# EAGLE board wuBaseV1.4PH (EAGLE 9.6.2), part 1 of 2
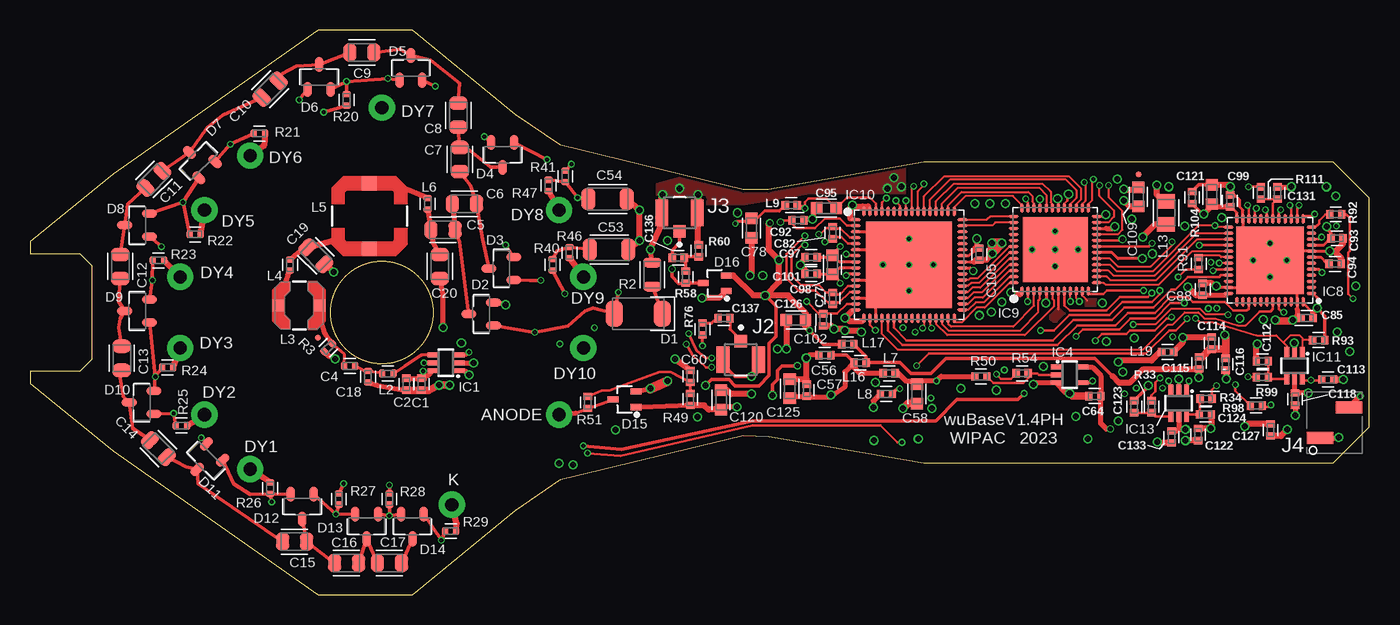
[diagram p5: board, top side]
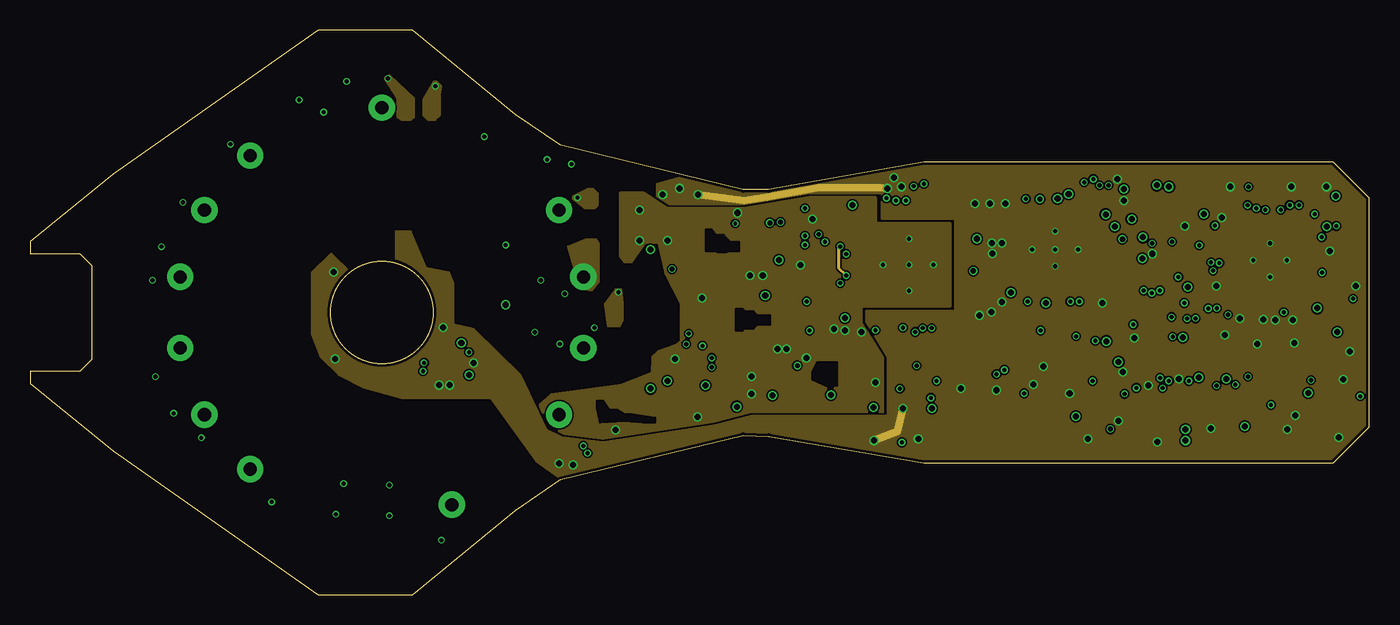
[diagram p6: board, inner layer Route2]
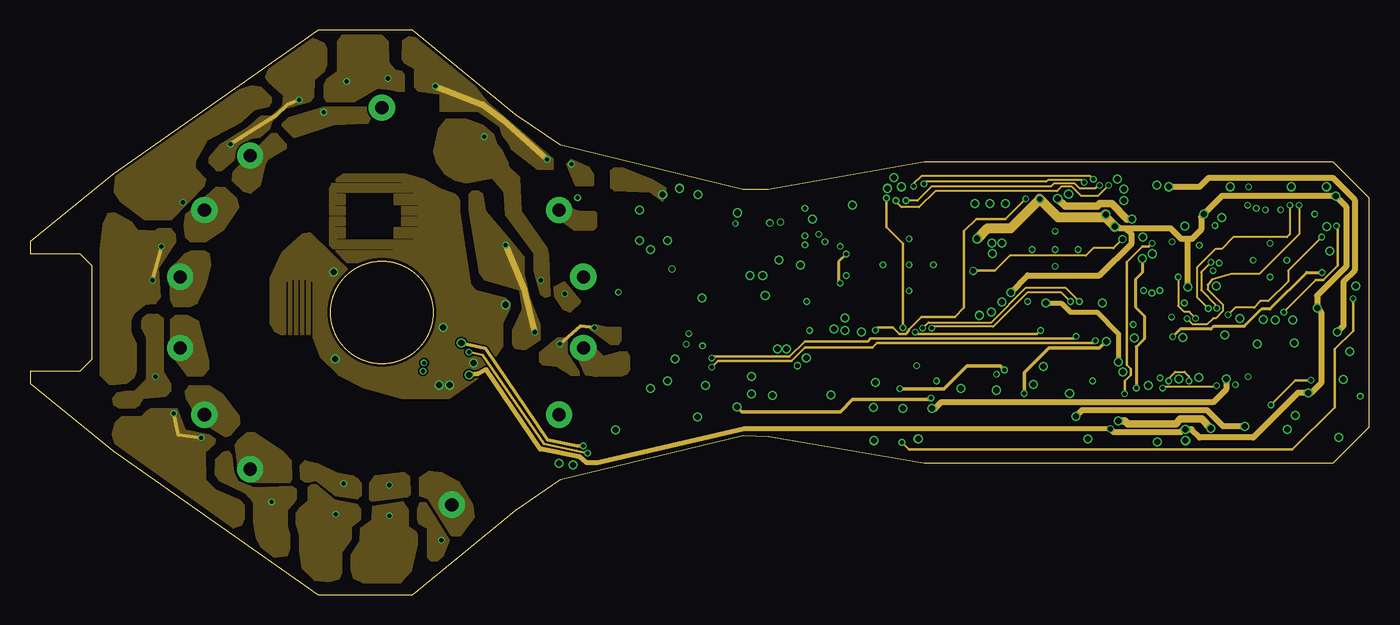
[diagram p7: board, inner layer Route15]
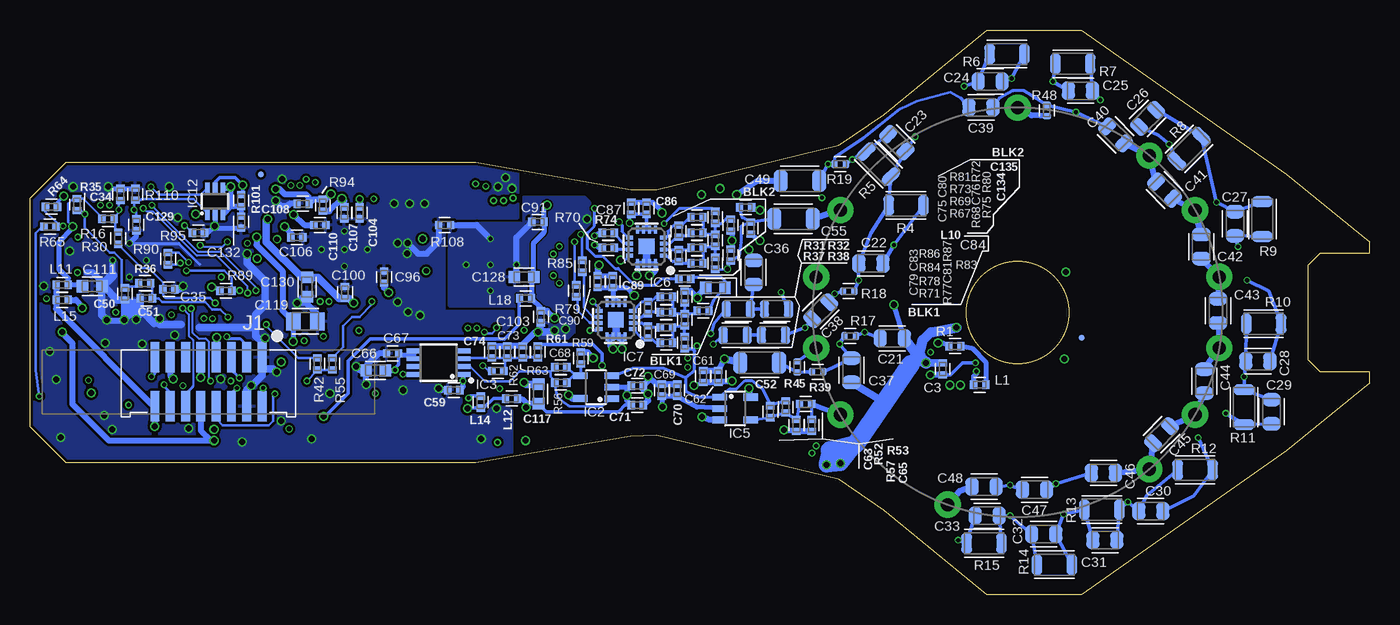
[diagram p8: board, bottom side, seen from below]

Size 111.2 x 46.9 mm. Coordinates in mm from the lower left corner, seen from the top.
Outline: 0,18.55 0,17.55 6.9,11.95 23.9,0 31.75,0 40.31,7.02 44.06,9.57 59.2,13.25 61.33,13.16 74.2,10.95 108.2,10.95 111.2,13.95 111.2,32.95 108.2,35.95 74.2,35.95 61.33,33.65 59.2,33.65 44.06,37.33 40.31,39.88 31.75,46.9 23.9,46.9 6.9,34.95 0,29.35 0,28.35 4.1,28.35 5.1,27.35 5.1,19.55 4.1,18.55 0,18.55
Outline: circle at 29.2,23.45 radius 4.25
Copper layers (1*2*15*16): Top 0.035mm / dielectric 0.23mm / Route2 0.035mm / dielectric 0.93mm / Route15 0.035mm / dielectric 0.23mm / Bottom 0.035mm
Design rules "MF_Standard_4_Layer": minimum track width 5mil, minimum drill 10mil, track to track 5mil, track to pad 5mil, pad to pad 5mil, via to via 5mil, smd to smd 0mil, copper to edge 10mil, drill to drill 10mil, minimum pad ring 4mil, minimum via ring 4mil, stop-mask expansion 2mil, vias tented up to drill 25mil, thermal gap 10mil

## Footprints (pad centres in the part's own frame; a part is rotated, then mirrored left to right if it is on the bottom)
0430-BARE = drill 1.092 pad 2.184: P$1 0,0
C0402 = smd 0.6 x 0.7: 1 -0.5,0; 2 0.5,0
C0402-HV = smd 0.56 x 0.7: 1 -0.47,0; 2 0.47,0
C0805-HV = smd 1.1 x 1.5: 1 -1,0; 2 1,0
C1206-HV = smd 1.165 x 1.815: 1 -1.6,0; 2 1.6,0
C0603 = smd 0.95 x 1: 1 -0.8,0; 2 0.8,0
C0805 = smd 1.2 x 1.5: 1 -1,0; 2 1,0
DO214AC-HV = smd 1.4 x 2.2: A 2,0; C -2,0
SOT23-ROUNDED = smd 1.242 x 0.694: 1 -1.029,0.95; 2 -1.029,-0.95; 3 1.029,0
SC70-3L = smd 0.5 x 0.9: 1 -0.65,-0.95; 2 0.65,-0.95; 3 0,0.95
FIDUCIAL_0.5MM = smd 0.5 x 0.5 bottom: FID_BOT 0,0 | smd 0.5 x 0.5: FID_TOP 0,0
SC70-6L-TI = smd 0.4 x 0.9: 1 -0.65,-1.1; 2 0,-1.1; 3 0.65,-1.1; 4 0.65,1.1; 5 0,1.1; 6 -0.65,1.1
SOT23-5 = smd 0.55 x 1.2: 1 -0.95,-1.3; 2 0,-1.3; 3 0.95,-1.3; 4 0.95,1.3 | smd 0.6 x 1.2: 5 -0.95,1.3
MSOP8 = smd 0.4 x 1.2: 1 -0.975,-2.05; 2 -0.325,-2.05; 3 0.325,-2.05; 4 0.975,-2.05; 5 0.975,2.05; 6 0.325,2.05; 7 -0.325,2.05; 8 -0.975,2.05
SC70-5L-TI = smd 0.4 x 0.9: 1 -0.65,-1.1; 2 0,-1.1; 3 0.65,-1.1; 4 0.65,1.1; 5 -0.65,1.1
LFCSP16 = smd 0.3 x 0.65: 1 -0.75,-1.4; 2 -0.25,-1.4; 3 0.25,-1.4; 4 0.75,-1.4; 9 0.75,1.4; 10 0.25,1.4; 11 -0.25,1.4; 12 -0.75,1.4 | smd 0.65 x 0.3: 5 1.4,-0.75; 6 1.4,-0.25; 7 1.4,0.25; 8 1.4,0.75; 13 -1.4,0.75; 14 -1.4,0.25; 15 -1.4,-0.25; 16 -1.4,-0.75 | smd 1.3 x 1.3: EXP 0,0
UFQFPN48-STMICRO = smd 0.86 x 0.27: 1 -3.435,2.75; 2 -3.435,2.25; 3 -3.435,1.75; 4 -3.435,1.25; 5 -3.435,0.75; 6 -3.435,0.25; 7 -3.435,-0.25; 8 -3.435,-0.75; 9 -3.435,-1.25; 10 -3.435,-1.75; 11 -3.435,-2.25; 12 -3.435,-2.75; 25 3.435,-2.75; 26 3.435,-2.25; 27 3.435,-1.75; 28 3.435,-1.25; 29 3.435,-0.75; 30 3.435,-0.25; 31 3.435,0.25; 32 3.435,0.75; 33 3.435,1.25; 34 3.435,1.75; 35 3.435,2.25; 36 3.435,2.75 | smd 0.27 x 0.86: 13 -2.75,-3.435; 14 -2.25,-3.435; 15 -1.75,-3.435; 16 -1.25,-3.435; 17 -0.75,-3.435; 18 -0.25,-3.435; 19 0.25,-3.435; 20 0.75,-3.435; 21 1.25,-3.435; 22 1.75,-3.435; 23 2.25,-3.435; 24 2.75,-3.435; 37 2.75,3.435; 38 2.25,3.435; 39 1.75,3.435; 40 1.25,3.435; 41 0.75,3.435; 42 0.25,3.435; 43 -0.25,3.435; 44 -0.75,3.435; 45 -1.25,3.435; 46 -1.75,3.435; 47 -2.25,3.435; 48 -2.75,3.435 | smd 5.6 x 5.6: 49 0,0
QFN48-ICE40ULTRA = smd 0.811 x 0.25: 1 -3.451,2.75; 2 -3.451,2.25; 3 -3.451,1.75; 4 -3.451,1.25; 5 -3.451,0.75; 6 -3.451,0.25; 7 -3.451,-0.25; 8 -3.451,-0.75; 9 -3.451,-1.25; 10 -3.451,-1.75; 11 -3.451,-2.25; 12 -3.451,-2.75; 25 3.451,-2.75; 26 3.451,-2.25; 27 3.451,-1.75; 28 3.451,-1.25; 29 3.451,-0.75; 30 3.451,-0.25; 31 3.451,0.25; 32 3.451,0.75; 33 3.451,1.25; 34 3.451,1.75; 35 3.451,2.25; 36 3.451,2.75 | smd 0.25 x 0.811: 13 -2.75,-3.451; 14 -2.25,-3.451; 15 -1.75,-3.451; 16 -1.25,-3.451; 17 -0.75,-3.451; 18 -0.25,-3.451; 19 0.25,-3.451; 20 0.75,-3.451; 21 1.25,-3.451; 22 1.75,-3.451; 23 2.25,-3.451; 24 2.75,-3.451; 37 2.75,3.451; 38 2.25,3.451; 39 1.75,3.451; 40 1.25,3.451; 41 0.75,3.451; 42 0.25,3.451; 43 -0.25,3.451; 44 -0.75,3.451; 45 -1.25,3.451; 46 -1.75,3.451; 47 -2.25,3.451; 48 -2.75,3.451 | smd 5.4 x 5.4: PAD 0,0
QFN64-LTC214X = smd 0.86 x 0.27: 1 -4.435,3.75; 2 -4.435,3.25; 3 -4.435,2.75; 4 -4.435,2.25; 5 -4.435,1.75; 6 -4.435,1.25; 7 -4.435,0.75; 8 -4.435,0.25; 9 -4.435,-0.25; 10 -4.435,-0.75; 11 -4.435,-1.25; 12 -4.435,-1.75; 13 -4.435,-2.25; 14 -4.435,-2.75; 15 -4.435,-3.25; 16 -4.435,-3.75; 33 4.435,-3.75; 34 4.435,-3.25; 35 4.435,-2.75; 36 4.435,-2.25; 37 4.435,-1.75; 38 4.435,-1.25; 39 4.435,-0.75; 40 4.435,-0.25; 41 4.435,0.25; 42 4.435,0.75; 43 4.435,1.25; 44 4.435,1.75; 45 4.435,2.25; 46 4.435,2.75; 47 4.435,3.25; 48 4.435,3.75 | smd 0.27 x 0.86: 17 -3.75,-4.435; 18 -3.25,-4.435; 19 -2.75,-4.435; 20 -2.25,-4.435; 21 -1.75,-4.435; 22 -1.25,-4.435; 23 -0.75,-4.435; 24 -0.25,-4.435; 25 0.25,-4.435; 26 0.75,-4.435; 27 1.25,-4.435; 28 1.75,-4.435; 29 2.25,-4.435; 30 2.75,-4.435; 31 3.25,-4.435; 32 3.75,-4.435; 49 3.75,4.435; 50 3.25,4.435; 51 2.75,4.435; 52 2.25,4.435; 53 1.75,4.435; 54 1.25,4.435; 55 0.75,4.435; 56 0.25,4.435; 57 -0.25,4.435; 58 -0.75,4.435; 59 -1.25,4.435; 60 -1.75,4.435; 61 -2.25,4.435; 62 -2.75,4.435; 63 -3.25,4.435; 64 -3.75,4.435 | smd 7.15 x 7.15: PAD 0,0
3M-45216-220230 = smd 0.737 x 2.54: 1 -4.445,-2.032; 2 -4.445,2.032; 3 -3.175,-2.032; 4 -3.175,2.032; 5 -1.905,-2.032; 6 -1.905,2.032; 7 -0.635,-2.032; 8 -0.635,2.032; 9 0.635,-2.032; 10 0.635,2.032; 11 1.905,-2.032; 12 1.905,2.032; 13 3.175,-2.032; 14 3.175,2.032; 15 4.445,-2.032; 16 4.445,2.032
HIROSE_U.FL-R-SMT-1 = smd 1 x 1.05: 1 0,-1.525 | smd 1.05 x 2.2: 2 1.475,0; 3 -1.475,0
HEADER-SMD-2X1-MINIMUM = smd 1 x 2.2: 1 -1.27,1.2; 2 1.27,-1.2
L0402 = smd 0.6 x 0.7: 1 -0.5,0; 2 0.5,0
L0402-HV = smd 0.56 x 0.7: 1 -0.47,0; 2 0.47,0
LPS4040-REDUCED = smd 1 x 1: 1 -1.7,0; 2 1.7,0
LPS6235-REDUCED = smd 1.2 x 1.2: 1 -2.7,0; 2 2.7,0
L0805 = smd 1.2 x 1.5: 1 -0.953,0; 2 0.953,0
R0402 = smd 0.6 x 0.7: 1 -0.5,0; 2 0.5,0
R0805-HV = smd 0.8 x 1.5: 1 -1,0; 2 1,0
R0402-HV = smd 0.56 x 0.7: 1 -0.47,0; 2 0.47,0
R1206-HV = smd 0.9 x 1.7: 1 -1.45,0; 2 1.45,0

## Placement (x,y rotation side)
ANODE  PAD-0430-BARE  [0430-BARE]  43.92,14.95 0 bottom
C1  1000pF  [C0402]  32.5,17.48 90 top
C2  0.1uF  [C0402]  31.23,17.48 90 top
C3  0.1uF  [C0402]  35.42,18.75 270 bottom
C4  0.1uF  [C0402-HV]  26.53,19 0 top
C5  2200pF/250V  [C0805-HV]  34.28,30.31 0 top
C6  2200pF/250V  [C0805-HV]  36.06,32.47 0 top
C7  2200pF/250V  [C0805-HV]  35.68,36.15 90 top
C8  2200pF/250V  [C0805-HV]  35.55,39.83 90 top
C9  2200pF/250V  [C0805-HV]  27.55,45.04 180 top
C10  2200pF/250V  [C0805-HV]  19.93,41.99 225 top
C11  2200pF/250V  [C0805-HV]  10.28,34.5 225 top
C12  2200pF/250V  [C0805-HV]  7.48,27.26 270 top
C13  2200pF/250V  [C0805-HV]  7.61,19.64 270 top
C14  2200pF/250V  [C0805-HV]  10.66,12.15 315 top
C15  2200pF/250V  [C0805-HV]  21.96,4.4 0 top
C16  2200pF/250V  [C0805-HV]  26.28,2.62 0 top
C17  2200pF/250V  [C0805-HV]  29.84,2.62 0 top
C18  100pF  [C0402-HV]  28.06,18.12 270 top
C19  3900pF/50V  [C0805-HV]  23.74,28.15 315 top
C20  220pF/100V/5%  [C0805-HV]  34.03,27.26 270 top
C21  2200pF/250V  [C0805-HV]  39.61,21.29 180 bottom
C22  2200pF/250V  [C0805-HV]  41.39,27.51 180 bottom
C23  2200pF/250V  [C0805-HV]  39.23,37.55 135 bottom
C24  2200pF/250V  [C0805-HV]  31.49,42.63 0 bottom
C25  2200pF/250V  [C0805-HV]  23.99,41.86 0 bottom
C26  2200pF/250V  [C0805-HV]  18.41,39.58 45 bottom
C27  2200pF/250V  [C0805-HV]  11.17,30.82 270 bottom
C28  2200pF/250V  [C0805-HV]  9.26,19.39 180 bottom
C29  2200pF/250V  [C0805-HV]  8.12,15.19 270 bottom
C30  2200pF/250V  [C0805-HV]  18.15,6.94 180 bottom
C31  2200pF/250V  [C0805-HV]  21.96,4.53 180 bottom
C32  2200pF/250V  [C0805-HV]  27.04,5.04 180 bottom
C33  2200pF/250V  [C0805-HV]  31.74,6.56 180 bottom
C34  0.1uF  [C0402]  103.71,33.24 90 bottom
C35  0.01uF  [C0402]  99.67,25.37 0 bottom
C36  2200pF/250V  [C0805-HV]  51.13,26.77 90 bottom
C37  2200pF/250V  [C0805-HV]  43,18.64 90 bottom
C38  2200pF/250V  [C0805-HV]  45.54,23.59 45 bottom
C39  2200pF/250V  [C0805-HV]  32.25,40.47 0 bottom
C40  2200pF/250V  [C0805-HV]  21.07,38.18 315 bottom
C41  2200pF/250V  [C0805-HV]  17.01,33.61 315 bottom
C42  2200pF/250V  [C0805-HV]  13.96,28.91 270 bottom
C43  2200pF/250V  [C0805-HV]  12.56,23.58 270 bottom
C44  2200pF/250V  [C0805-HV]  13.71,17.73 270 bottom
C45  2200pF/250V  [C0805-HV]  17.26,13.29 225 bottom
C46  2200pF/250V  [C0805-HV]  22.09,10.11 180 bottom
C47  2200pF/250V  [C0805-HV]  27.8,8.72 180 bottom
C48  2200pF/250V  [C0805-HV]  31.99,8.97 180 bottom
C49  10000pF/500V  [C1206-HV]  47.29,34.37 180 bottom
C50  0.1uF  [C0402]  103.33,24.99 270 bottom
C51  0.01uF  [C0402]  101.55,24.61 180 bottom
C52  10000pF/500V  [C1206-HV]  50.62,19.27 0 bottom
C53  10000pF/500V  [C1206-HV]  48.08,28.67 0 top
C54  10000pF/500V  [C1206-HV]  47.96,32.86 0 top
C55  10000pF/500V  [C1206-HV]  47.83,31.21 180 bottom
C56  0.1uF  [C0402]  65.99,19.91 180 top
C57  1000pF  [C0402]  64.47,16.99 90 top
C58  1uF  [C0603]  73.63,16.68 270 top
C59  0.01uF  [C0402]  76.02,16.99 180 bottom
C60  0.1uF  [C0402]  54.81,18.13 90 top
C61  0.1uF  [C0402]  55.32,18.13 90 bottom
C62  1000pF  [C0402]  54.05,18.13 90 bottom
C63  8pF  [C0402]  49.73,15.21 90 bottom
C64  0.1uF  [C0402]  88.4,16.5 0 top
C65  20pF  [C0402]  46.3,14.07 270 bottom
C66  1uF  [C0603]  82.5,18.64 180 bottom
C67  0.01uF  [C0402]  81.1,20.04 180 bottom
C68  DNL  [C0402]  67.13,18.89 180 bottom
C69  0.1uF  [C0402]  58.75,16.99 90 bottom
C70  1000pF  [C0402]  57.48,16.99 90 bottom
C71  0.1uF  [C0402]  60.78,15.74 0 bottom
C72  1000pF  [C0402]  60.78,17.37 0 bottom
C73  0.1uF  [C0402]  71.58,20.16 90 bottom
C74  1000pF  [C0402]  72.85,20.16 90 bottom
C75  3pF  [C0402]  57.35,28.16 90 bottom
C76  7.5pF  [C0402]  54.31,29.43 90 bottom
C77  7.5pF  [C0402]  66.62,24.61 270 top
C78  1uF  [C0603]  59.89,30.45 270 top
C79  4pF  [C0402]  59.89,21.81 90 bottom
C80  3pF  [C0402]  57.35,30.2 90 bottom
C81  8pF  [C0402]  56.85,22.83 90 bottom
C82  11pF  [C0402]  66.62,30.07 90 top
C83  4pF  [C0402]  59.89,23.85 90 bottom
C84  1uF  [C0603]  54.31,25.5 180 bottom
C85  0.1uF  [C0402]  106.02,22.98 180 top
C86  1000pF  [C0402]  60.02,32.1 90 bottom
C87  0.1uF  [C0402]  61.29,32.1 90 bottom
C88  0.1uF  [C0402]  97.36,25.37 90 top
C89  1000pF  [C0402]  62.81,26.01 90 bottom
C90  0.1uF  [C0402]  64.08,26.01 90 bottom
C91  0.1uF  [C0402]  69.04,30.96 180 bottom
C92  0.1uF  [C0402]  63.76,31.11 0 top
C93  0.1uF  [C0402]  108.51,29.61 0 top
C94  0.1uF  [C0402]  108.36,27.48 0 top
C95  2.2uF  [C0603]  66.12,32.1 180 top
C96  0.1uF  [C0402]  81.81,26.39 90 bottom
C97  0.1uF  [C0402]  64.85,28.04 180 top
C98  2.2uF  [C0603]  66.62,27.4 270 top
C99  0.1uF  [C0402]  99.62,32.71 90 top
C100  0.1uF  [C0402]  85.05,25.11 90 bottom
C101  0.1uF  [C0402]  64.85,26.64 180 top
C102  0.1uF  [C0402]  65.86,22.83 270 top
C103  0.1uF  [C0402]  68.78,23.09 270 bottom
C104  0.1uF  [C0402]  83.84,31.72 270 bottom
C105  0.1uF  [C0402]  78.82,28.29 270 top
C106  0.1uF  [C0402]  89.05,29.69 0 bottom
C107  0.1uF  [C0402]  85.11,31.72 270 bottom
C108  0.1uF  [C0402]  88.54,32.48 180 bottom
C109  1uF  [C0603]  92,33.05 270 top
C110  0.1uF  [C0402]  87.14,30.7 0 bottom
C111  4.7uF  [C0603]  106.04,25.62 180 bottom
C112  100pF  [C0402]  102.31,19.4 180 top
C113  100pF  [C0402]  107.75,17.88 0 top
C114  0.1uF  [C0402]  98.1,20.9 270 top
C115  0.1uF  [C0402]  97.05,19.25 90 top
C116  0.1uF  [C0402]  99.26,19.15 90 top
C117  2.2uF  [C0603]  68.99,16.68 270 bottom
C118  0.1uF  [C0402]  105.03,16.25 270 top
C119  10uF/6.3V  [C0805]  88.34,22.7 0 bottom
C120  2.2uF  [C0603]  57.38,16.17 270 top
C121  4.7uF  [C0603]  98.12,33.24 270 top
C122  0.1uF  [C0402]  96.98,13.31 90 top
C123  100pF  [C0402]  91.67,15.62 90 top
C124  100pF  [C0402]  97.59,14.98 0 top
C125  2.2uF  [C0603]  63.07,17.12 270 top
C126  2.2uF  [C0603]  63.58,22.83 0 top
C127  0.1uF  [C0402]  103,13.69 270 top
C128  4.7uF  [C0603]  70.18,26.39 0 bottom
C129  0.1uF  [C0402]  102.39,30.73 90 bottom
C130  4.7uF  [C0603]  88.22,25.55 270 bottom
C131  0.1uF  [C0402]  103.58,33.37 270 top
C132  0.1uF  [C0402]  93.68,30.96 90 bottom
C133  0.1uF  [C0402]  94.77,13.1 270 top
C134  33pF  [C0402]  51.38,30.45 270 bottom
C135  3pF  [C0402]  51.79,32.17 0 bottom
C136  0.1uF  [C0402]  53.82,27.98 180 top
C137  0.1uF  [C0402]  57.61,22.96 180 top
D1  SMAJ150A  [DO214AC-HV]  50.5,23.34 180 top
D2  BAS101S,215  [SOT23-ROUNDED]  37.45,23.32 180 top
D3  BAS101S,215  [SOT23-ROUNDED]  39.12,27.11 180 top
D4  BAS101S,215  [SOT23-ROUNDED]  39.23,36.53 270 top
D5  BAS101S,215  [SOT23-ROUNDED]  31.61,43.77 90 top
D6  BAS101S,215  [SOT23-ROUNDED]  23.99,43.01 90 top
D7  BAS101S,215  [SOT23-ROUNDED]  13.96,36.02 135 top
D8  BAS101S,215  [SOT23-ROUNDED]  8.88,30.69 180 top
D9  BAS101S,215  [SOT23-ROUNDED]  8.88,23.58 180 top
D10  BAS101S,215  [SOT23-ROUNDED]  9.26,15.96 180 top
D11  BAS101S,215  [SOT23-ROUNDED]  14.59,11.13 225 top
D12  BAS101S,215  [SOT23-ROUNDED]  22.6,7.32 270 top
D13  BAS101S,215  [SOT23-ROUNDED]  27.93,5.67 270 top
D14  BAS101S,215  [SOT23-ROUNDED]  31.74,5.67 270 top
D15  BAV99W,115  [SC70-3L]  49.35,16.23 90 top
D16  BAV99W,115  [SC70-3L]  56.85,25.88 90 top
DY1  PAD-0430-BARE  [0430-BARE]  18.27,10.43 0 bottom
DY2  PAD-0430-BARE  [0430-BARE]  14.48,14.95 0 bottom
DY3  PAD-0430-BARE  [0430-BARE]  12.46,20.5 0 bottom
DY4  PAD-0430-BARE  [0430-BARE]  12.46,26.4 0 bottom
DY5  PAD-0430-BARE  [0430-BARE]  14.48,31.95 0 bottom
DY6  PAD-0430-BARE  [0430-BARE]  18.27,36.47 0 bottom
DY7  PAD-0430-BARE  [0430-BARE]  29.2,40.45 0 bottom
DY8  PAD-0430-BARE  [0430-BARE]  43.92,31.95 0 bottom
DY9  PAD-0430-BARE  [0430-BARE]  45.94,26.4 0 bottom
DY10  PAD-0430-BARE  [0430-BARE]  45.94,20.5 0 bottom
FID1  [FIDUCIAL_0.5MM]  23.89,21.34 0 top
FID2  [FIDUCIAL_0.5MM]  92.03,34.9 0 top
IC1  74LVC1T45DCK  [SC70-6L-TI]  34.53,19.26 90 top
IC2  AD8014ART  [SOT23-5]  64.21,17.24 90 bottom
IC3  MAX9013EUA  [MSOP8]  77.29,19.27 90 bottom
IC4  SN74AUC1G17DCK  [SC70-5L-TI]  86.31,18.26 270 top
IC5  AD8014ART  [SOT23-5]  52.66,15.46 270 bottom
IC6  THS4551IRGT  [LFCSP16]  60.02,28.93 90 bottom
IC7  THS4551IRGT  [LFCSP16]  62.56,22.83 90 bottom
IC8  STM32L552CCU  [UFQFPN48-STMICRO]  102.95,27.78 180 top
IC9  ICE40UP5K-SG48I  [QFN48-ICE40ULTRA]  85.11,28.67 90 top
IC10  LTC2142IUP-12  [QFN64-LTC214X]  72.97,27.4 0 top
IC11  74AUP2G3404GW  [SC70-6L-TI]  104.98,19.02 180 top
IC12  INA199C2DCK  [SC70-6L-TI]  95.84,32.69 0 bottom
IC13  74AUP2G3404GW  [SC70-6L-TI]  95.38,15.91 180 top
J1  HDR-16  [3M-45216-220230]  96.39,17.68 180 bottom
J2  COAX-2GNDU.FL  [HIROSE_U.FL-R-SMT-1]  59,19.53 180 top
J3  COAX-2GNDU.FL  [HIROSE_U.FL-R-SMT-1]  53.92,31.72 0 top
J4  HDR-2-SMD  [HEADER-SMD-2X1-MINIMUM]  108.31,14.3 90 top
K  PAD-0430-BARE  [0430-BARE]  35.01,7.47 0 bottom
L1  MMZ1005S601HTD25  [L0402]  32.35,17.43 0 bottom
L2  MMZ1005A222ETD25  [L0402-HV]  29.71,18.37 180 top
L3  1000uH/LPS4040  [LPS4040-REDUCED]  22.34,24.02 0 top
L4  MMZ1005A222ETD25  [L0402-HV]  21.58,27.39 90 top
L5  10000uH/LPS6235  [LPS6235-REDUCED]  28.18,31.45 270 top
L6  MMZ1005A222ETD25  [L0402-HV]  33.01,32.47 90 top
L7  MMZ1005S601HTD25  [L0402]  71.32,18.39 180 top
L8  MMZ1005S601HTD25  [L0402]  71.09,16.68 180 top
L9  MMZ1005A222ETD25  [L0402]  63.2,32.36 180 top
L10  MMZ1005A222ETD25  [L0402]  56.85,26.26 0 bottom
L11  MMZ1005S601HTD25  [L0402]  108.53,25.75 0 bottom
L12  MMZ1005A222ETD25  [L0402]  71.22,16.3 0 bottom
L13  MLZ2012N101LT  [L0805]  94.31,31.72 270 top
L14  MMZ1005A222ETD25  [L0402]  73.79,16 90 bottom
L15  MMZ1005S601HTD25  [L0402]  108.53,24.48 0 bottom
L16  MMZ1005A222ETD25  [L0402]  68.91,19.27 180 top
L17  MMZ1005A222ETD25  [L0402]  67.89,20.8 180 top
L18  MMZ1005S601HTD25  [L0402]  70.05,24.61 0 bottom
L19  MMZ1005S601HTD25  [L0402]  94.44,20.16 180 top
R1  1  [R0402]  34.41,20.66 0 bottom
R2  1M/150V  [R0805-HV]  51.66,26.59 270 top
R3  390K  [R0402-HV]  24.75,20.53 45 top
R4  200M/200V  [R1206-HV]  38.47,32.34 180 bottom
R5  200M/200V  [R1206-HV]  40.76,35.77 135 bottom
R6  200M/200V  [R1206-HV]  30.09,44.91 0 bottom
R7  200M/200V  [R1206-HV]  24.63,44.1 0 bottom
R8  200M/200V  [R1206-HV]  14.98,37.04 45 bottom
R9  200M/200V  [R1206-HV]  8.88,31.2 270 bottom
R10  200M/200V  [R1206-HV]  8.78,22.51 180 bottom
R11  200M/200V  [R1206-HV]  10.4,15.58 270 bottom
R12  200M/200V  [R1206-HV]  14.47,10.37 180 bottom
R13  200M/200V  [R1206-HV]  22.21,7.07 180 bottom
R14  200M/200V  [R1206-HV]  26.15,2.5 180 bottom
R15  200M/200V  [R1206-HV]  31.99,4.27 180 bottom
R16  1.1M  [R0402]  104.73,31.21 0 bottom
R17  390K  [R0402-HV]  43.1,21.48 180 bottom
R18  390K  [R0402-HV]  43.23,25.21 180 bottom
R19  390K  [R0402-HV]  43.93,35.77 180 bottom
R20  390K  [R0402-HV]  26.28,41.1 270 top
R21  390K  [R0402-HV]  19.04,38.31 0 top
R22  390K  [R0402-HV]  13.71,29.93 0 top
R23  390K  [R0402-HV]  10.66,27.77 0 top
R24  390K  [R0402-HV]  11.42,18.88 0 top
R25  390K  [R0402-HV]  12.56,14.05 0 top
R26  390K  [R0402-HV]  19.93,8.84 90 top
R27  390K  [R0402-HV]  25.64,7.96 90 top
R28  390K  [R0402-HV]  29.84,7.96 90 top
R29  390K  [R0402-HV]  34.91,5.29 0 top
R30  10M  [R0402]  103.89,29.61 270 bottom
R31  47M/150V  [R0805-HV]  52.4,23.72 0 bottom
R32  47M/150V  [R0805-HV]  49.23,23.72 0 bottom
R33  27  [R0402]  93.11,15.61 270 top
R34  27  [R0402]  97.64,16.28 180 top
R35  1.1M  [R0402]  107.32,32.41 270 bottom
R36  10M  [R0402]  101.68,25.88 0 bottom
R37  47M/150V  [R0805-HV]  52.66,21.56 0 bottom
R38  47M/150V  [R0805-HV]  49.48,21.56 0 bottom
R39  390K  [R0402-HV]  45.8,18.51 180 bottom
R40  390K  [R0402-HV]  43.38,27.4 90 top
R41  390K  [R0402-HV]  44.44,34.75 270 top
R42  1K  [R0402]  87.35,19.17 90 bottom
R45  49.9  [R0402-HV]  47.5,18.92 90 bottom
R46  49.9  [R0402-HV]  44.78,28.42 270 top
R47  100K  [R0402-HV]  43.04,33.99 270 top
R48  49.9  [R0402-HV]  26.79,40.21 270 bottom
R49  1K  [R0402]  54.81,16.23 90 top
R50  510  [R0402]  78.94,18.13 180 top
R51  47K  [R0402]  46.3,15.97 270 top
R52  1.2K  [R0402]  48.46,15.59 270 bottom
R53  22  [R0402]  46.81,15.85 0 bottom
R54  270  [R0402]  82.37,18.39 0 top
R55  200  [R0402]  86.11,19.17 90 bottom
R56  1K  [R0402]  67.13,17.62 180 bottom
R57  1K  [R0402]  47.58,14.07 270 bottom
R58  DNL  [R0402]  54.43,26.39 270 top
R59  200  [R0402]  65.48,19.66 90 bottom
R60  56  [R0402]  55.5,28.57 90 top
R61  DNL  [R0402]  69.04,20.16 90 bottom
R62  270K  [R0402]  72.36,18.58 180 bottom
R63  DNL  [R0402]  70.31,20.16 90 bottom
R64  20K  [R0402]  109.42,32.23 180 bottom
R65  1K  [R0402]  109.55,30.58 180 bottom
R67  1.8K  [R0402]  55.83,27.53 180 bottom
R68  750  [R0402]  54.31,27.53 90 bottom
R69  330  [R0402]  55.83,28.8 180 bottom
R70  220  [R0402]  63.2,28.8 180 bottom
R71  1.8K  [R0402]  58.37,20.93 180 bottom
R72  2.7K  [R0402]  54.31,31.34 270 bottom
R73  330  [R0402]  55.83,30.07 180 bottom
R74  220  [R0402]  63.2,30.07 180 bottom
R75  430  [R0402]  53.04,28.22 270 bottom
R76  1K  [R0402]  55.83,22.07 90 top
R77  1.2K  [R0402]  56.85,20.93 90 bottom
R78  240  [R0402]  58.37,22.2 180 bottom
R79  220  [R0402]  65.86,25.24 90 bottom
R80  2.2K  [R0402]  53.04,30.7 90 bottom
R81  1.8K  [R0402]  55.83,31.34 180 bottom
R83  2.4K  [R0402]  55.32,23.59 180 bottom
R84  240  [R0402]  58.37,23.47 180 bottom
R85  220  [R0402]  65.36,27.28 90 bottom
R86  1.8K  [R0402]  58.37,24.74 180 bottom
R87  2.4K  [R0402]  56.85,24.74 270 bottom
R89  2.2K  [R0402]  94.95,25.24 0 bottom
R90  1K  [R0402]  99.75,27.91 270 bottom
R91  100  [R0402]  97.03,27.5 90 top
R92  1K  [R0402]  108.41,31.59 180 top
R93  20K  [R0402]  106.99,21.15 0 top
R94  100  [R0402]  86.89,32.36 90 bottom
R95  10K  [R0402]  97.23,30.07 0 bottom
R98  27  [R0402]  101.8,15.72 0 top
R99  27  [R0402]  102.31,18.06 0 top
R101  1  [R0402]  93.68,32.74 270 bottom
R104  100K  [R0402]  96.47,32.99 270 top
R108  0  [R0402]  76.78,30.7 180 bottom
R110  100K  [R0402]  102.46,33.27 90 bottom
R111  100K  [R0402]  102.19,33.37 90 top

## Tracks (layer width: path | path; a pad name or v marks a point on that pad's centre or on a via)
(CDONE)
  Top 0.203: IC9.7 85.36,23.72
  pour Top: 85.4,23.85 85.88,23.36 85.2,22.69 84.95,22.69 84.73,22.91 84.73,23.18
(FPGA_PIN11)
  Top 0.152: 87.78,24.43 87.36,24.85 IC9.11
  pour Top: 87.65,24.56 88.6,24.56 88.6,23.97 87.65,23.97
+VAMP  (via drill 0.35, 0.4, 0.5)
  Top 0.305: v61.04,24.86 61.93,23.97 61.93,21.43 61.37,20.88 61.37,18.21 60.5,17.34 58.55,17.34 58.03,17.86 56.58,17.86 v56.08,17.37 | v64.72,21.94 65.86,20.8 L17.2
  Top 0.406: D15.2 v51.51,17.12
  Top 0.508: v61.04,24.86 62.94,24.86 64.38,23.43 C126.2 64.38,22.29 v64.72,21.94 | v61.04,24.86 62.18,26.01 v62.18,27.78 61.29,28.67 61.29,30.76 v61.42,30.88 | v61.04,24.86 61.02,24.88 60.03,24.88 58.38,26.53 D16.2
  Top 0.813: v51.51,17.12 v52.91,17.75
  Bottom 0.254: IC7.5 IC7.6 IC7.7 IC7.8 | IC7.12 64.07,22.08 64.21,21.94 v64.72,21.94 | v62.18,27.78 61.81,27.78 IC6.12
  Bottom 0.305: 60.02,30.33 IC6.7 IC6.8 | 60.02,30.33 IC6.6 IC6.5 | v61.42,30.88 61.42,31.48 C87.1 C86.1 | 60.02,31.47 60.02,30.33 | C61.1 v56.08,17.37
  Bottom 0.406: C86.1 60.02,31.47 | C90.1 C89.1 | C89.1 62.81,24.68 62.31,24.3 IC7.6 | C89.1 61.68,25.51 v61.04,24.86
  Bottom 0.508: IC5.5 v51.51,17.12 | v52.91,17.75 C62.1 C61.1
+VAMP2  (via drill 0.5)
  Top 0.305: L16.2 67.78,19.91 C56.1
  Top 0.406: C125.2 63.2,16.44 64.42,16.44 C57.1 64.55,16.41 66.3,16.41 v66.5,16.61 66.88,16.73 67.65,17.25 67.65,18.51 L16.2 68.41,18.89 68.88,18.42 70.82,18.42 L7.2
  Bottom 0.508: IC2.5 66.18,16.29 v66.5,16.61
+VDISC  (via drill 0.35)
  Top 0.406: R50.2 75.64,18.13 v75.26,17.75 73.91,17.75 C58.1 73.38,17.73 72.76,17.73 72.11,18.39 L7.1
  Bottom 0.203: v75.26,17.75 75.24,17.73
  Bottom 0.406: IC3.1 75.24,17.73 75.24,17.27 C59.1
-DISCRIM_BUFOUT  (via drill 0.35)
  Top 0.203: v88.22,17.75 88.07,17.61 IC4.4
  Bottom 0.203: v88.22,17.75 87.35,18.62 R42.1 R55.1
-DISCRIM_OUT  (via drill 0.35)
  Top 0.203: v80.24,18.31 80.62,17.93 81.42,17.93 R54.1
  Bottom 0.254: v80.24,18.31 v80.23,18.3 IC3.8
-DISCRIM_OUT_DIVIDER
  Top 0.203: IC4.2 83.77,18.26 83.64,18.39 R54.2 82.87,18 82.47,17.6 79.98,17.6 R50.1
-DISCRIM_OUT_FPGA  (via drill 0.35)
  Top 0.203: IC9.2 82.86,24.39 v82.82,24.36
  Bottom 0.203: v82.82,24.36 82.82,24.1 83.84,23.09 84.47,23.09 85.22,22.34 85.22,20.56 R55.2
-DISCRIM_OUT_MCU  (via drill 0.35)
  Top 0.152: v91.59,22.45 93.42,22.45 94.72,23.75 97.16,23.75 97.61,23.29 99.44,23.29 v99.47,23.26
  Top 0.203: v107.24,29.71 107.06,29.53 IC8.10
  Route15 0.152: 101.63,23.85 100.05,23.85 v99.47,23.26 | v107.24,29.71 104.45,26.92 104.45,26.03 102.8,24.38 102.16,24.38
  Route15 0.203: 102.16,24.38 101.63,23.85
  Bottom 0.203: R42.2 88.94,19.67 91.59,22.32 v91.59,22.45
-VAMP  (via drill 0.35, 0.5)
  Top 0.406: R49.1 50.66,15.58 D15.1 | v58.67,15.62 57.62,15.62 C120.2
  Top 0.508: C120.2 56.33,15.37 55.97,15.73 R49.1
  Route15 0.305: v58.67,15.62 59.1,15.19 67.27,15.19 68.28,16.21 74.67,16.21 v74.79,16.34
  Bottom 0.305: L14.2 74.63,16.5 v74.79,16.34
  Bottom 0.406: IC5.2 55.83,15.59 C70.1 C69.1 58.75,15.69 v58.67,15.62
-VAMP2  (via drill 0.4, 0.5)
  Top 0.305: v63.7,19.02 62.43,19.02 62.05,18.64 62.05,17.88 61.65,17.47 v61.65,16.56
  Top 0.406: L8.2 70.02,16.1 v70.02,15.55
  Bottom 0.305: v63.7,19.02 63.7,20.03 64.47,20.79 68.91,20.79 R61.2 | C71.1 61.8,15.74 62.35,15.19 68.3,15.19 C117.2
  Bottom 0.406: C71.1 61.65,16.11 v61.65,16.56 61.65,17.01 C72.1 61.41,17.24 IC2.2 | v70.02,15.55 70.02,15.96 | L12.2 70.36,16.3 70.02,15.96 | C117.2 69.94,15.88 70.02,15.96
-VDISC  (via drill 0.35)
  Top 0.305: L8.1 72.03,17.12 v72.21,17.12
  Route15 0.305: v80.9,18.66 80.54,19.02 77.8,19.02 75.88,17.1 72.23,17.1 v72.21,17.12
  Bottom 0.305: v80.9,18.66 80.9,18.84 80.6,19.14 C67.1
  Bottom 0.406: C66.1 80.92,18.64 v80.9,18.66 | IC3.5 79.34,19.91 | 79.34,19.91 IC3.6 | C67.1 80.48,19.91 79.34,19.91
ADC1_IN8  (via drill 0.35)
  Top 0.203: v106.66,31.62 106.5,31.47 105.82,31.47 105.7,31.35 IC8.13
  Bottom 0.203: R35.2 106.94,31.91 v106.66,31.62 106.66,30.48 104.6,28.42 104.22,28.42 103.58,27.78 103.58,25.71 C50.1 103.2,25.62 102.44,25.62 R36.1
ADC1_IN12  (via drill 0.35)
  Top 0.203: IC8.17 103.7,31.84 v103.84,31.98
  Bottom 0.203: C34.1 103.84,32.62 v103.84,31.98 103.84,31.72 104.23,31.33 R16.2 104.23,30.96 104.14,30.88 104.14,30.37 R30.1
ADC1_IN15
  Top 0.203: R111.1 C131.2 103.2,32.49 IC8.18
ADC1_IN16  (via drill 0.35)
  Top 0.203: IC8.19 102.7,31.84 v102.57,31.98
  Bottom 0.203: C129.2 102.39,31.8 v102.57,31.98 102.57,32.67 R110.1 102.02,32.77 101.93,32.86 97.64,32.86 96.48,31.71 IC12.1
ADC_!CS
  Top 0.152: 102.11,23.54 100.94,22.37 100.26,22.37 98.42,22.94 97.5,22.94 96.99,23.45 95.88,23.45 94.86,22.43 94.48,22.43 92.42,20.38 72.02,20.38 70.72,21.68 IC10.20
  Top 0.203: IC8.43 103.2,23.72 103.02,23.54 102.11,23.54
ADC_CLKOUT  (via drill 0.45)
  Top 0.203: v90.7,29.54 90.58,29.42 IC9.20
  Top 0.254: IC10.40 78.05,27.15 v78.31,26.89
  Route15 0.152: 80.12,26.91 81.37,28.16 87.65,28.16 88.28,28.8 89.96,28.8
  Route15 0.203: 80.12,26.91 78.33,26.91 v78.31,26.89 | v90.7,29.54 89.96,28.8
ADC_ENC  (via drill 0.35)
  Top 0.203: IC9.35 82.86,32.57 82.67,32.76 v82.67,32.89 | v70.18,21.97 70.16,21.97 69.72,22.4 IC10.18
  Route15 0.203: v82.67,32.89 81,31.21 78.56,31.21 77.55,30.2 77.55,23.85 76.78,23.09 74.02,23.09 72.98,22.05 72.98,21.94 72.7,21.66 72.19,21.66 71.66,22.2 70.41,22.2 v70.18,21.97
ADC_OUT1_0
  Top 0.152: IC9.38 80.14,30.92 79.88,30.67 77.43,30.67 IC10.47
ADC_OUT1_1
  Top 0.152: IC9.37 79.71,31.42 79.44,31.15 IC10.48
ADC_OUT1_2
  Top 0.152: IC9.36 82.36,32.38 81.62,33.12 77.66,33.12 76.72,32.18 IC10.49
ADC_OUT1_3
  Top 0.152: IC10.50 76.22,32.33 77.34,33.45 82.88,33.45 83.21,33.11 83.21,32.68 83.36,32.53 IC9.34
ADC_OUT1_4
  Top 0.152: IC10.51 75.72,32.49 77.04,33.8 83.79,33.8 84.4,33.19 84.4,32.41 84.35,32.36 84.35,32.14 IC9.32
ADC_OUT1_5
  Top 0.152: IC10.52 75.22,32.68 76.68,34.13 84.07,34.13 84.73,33.47 84.73,32.58 84.86,32.45 IC9.31
ADC_OUT1_6
  Top 0.152: IC10.53 74.72,32.84 76.35,34.46 86,34.46 86.87,33.59 86.87,32.96 86.36,32.45 IC9.28
ADC_OUT1_7
  Top 0.152: IC10.54 74.22,33.1 75.9,34.77 86.25,34.77 87.24,33.78 87.24,32.81 86.86,32.43 IC9.27
ADC_OUT1_8  (via drill 0.35)
  Top 0.152: IC10.55 73.72,33.51 74.22,34.01 v74.22,34.13 | IC9.26 87.36,32.45 87.61,32.71 87.61,34.17 v87.52,34.26
  Route15 0.152: v87.52,34.26 87.34,34.44 84.5,34.44 84.37,34.31 74.4,34.31 v74.22,34.13
ADC_OUT1_9  (via drill 0.35)
  Top 0.152: IC10.56 73.22,33.8 v73.36,33.93 | v88.28,34.52 88.16,34.39 88.16,32.75 87.86,32.45 IC9.25
  Route15 0.152: v88.28,34.52 88.03,34.77 73.99,34.77 73.36,34.13 v73.36,33.93
ADC_OUT1_10  (via drill 0.35)
  Top 0.152: IC10.57 v72.72,32.73 v72.72,32.74 | v88.79,34.01 88.79,33.12 90,31.91 90,31.4 89.52,30.92 IC9.23
  Route15 0.152: v88.79,34.01 88.67,34.01 88.41,33.75 87.14,33.75 86.74,34.16 85.01,34.16 84.75,33.91 74.86,33.91 73.69,32.74 v72.72,32.74
ADC_OUT1_11  (via drill 0.35)
  Top 0.152: IC10.58 72.22,32.31 71.88,32.65 v71.88,32.74 | v89.55,34.01 89.55,32.99 90.7,31.85 90.7,30.32 90.3,29.92 IC9.21
  Route15 0.152: v89.55,34.01 88.67,33.12 87.27,33.12 86.51,33.88 85.62,33.88 85.26,33.52 75.16,33.52 73.81,32.18 72.36,32.18 71.88,32.66 v71.88,32.74
ADC_OUT2_0  (via drill 0.35)
  Top 0.152: IC10.27 74.22,22.25 v74.12,22.14 | v87.12,24.36 86.86,24.61 IC9.10
  Route15 0.152: v74.12,22.14 74.6,22.63 79.83,22.63 82.7,25.5 85.97,25.5 v87.12,24.36
ADC_OUT2_1  (via drill 0.35)
  Top 0.152: IC10.28 74.72,22.48 74.86,22.35 v74.86,22.14 | v86.38,24.36 86.36,24.38 IC9.9
  Route15 0.152: v86.38,24.36 85.62,25.12 82.82,25.12 79.98,22.27 74.98,22.27 v74.86,22.14
ADC_OUT2_2
  Top 0.152: IC10.29 75.22,22.49 76.15,21.56 82.59,21.56 84.98,23.95 84.98,24.46 84.86,24.59 IC9.6
ADC_OUT2_3
  Top 0.152: IC10.30 75.72,22.49 76.3,21.92 82.16,21.92 83.71,23.47 83.71,24.44 83.86,24.59 IC9.4
ADC_OUT2_4
  Top 0.152: IC10.31 76.22,22.53 76.48,22.27 81.63,22.27 83.36,24 IC9.3
ADC_OUT2_5
  Top 0.152: IC10.32 76.72,22.75 76.85,22.62 77.36,22.62 78.58,23.84 79.26,23.84 81.34,25.92 IC9.48
ADC_OUT2_6
  Top 0.152: IC10.33 77.88,23.65 78.52,24.29 79.2,24.29 81.34,26.42 IC9.47
ADC_OUT2_7
  Top 0.152: IC10.34 77.88,24.15 78.42,24.69 79.09,24.69 81.33,26.92 IC9.46
ADC_OUT2_8
  Top 0.152: IC10.35 77.88,24.65 78.34,25.11 79.01,25.11 81.32,27.42 IC9.45
ADC_OUT2_9
  Top 0.152: IC10.36 77.88,25.15 78.23,25.51 78.9,25.51 81.31,27.92 IC9.44
ADC_OUT2_10
  Top 0.152: IC10.37 77.88,25.65 78.14,25.91 78.79,25.91 81.3,28.42 IC9.43
ADC_OUT2_11
  Top 0.152: IC10.38 77.92,26.15 78.05,26.28 78.65,26.28 81.3,28.92 IC9.42
AGND  (via drill 0.35, 0.5)
  Top 0.254: IC10.6 71.72,28.65 | 71.72,28.65 IC10.PAD 71.72,26.15 | IC10.11 71.72,26.15 | IC10.3 70.22,30.15 71.72,28.65 | IC10.19 70.22,24.65 | 70.22,24.65 71.72,26.15 | IC10.14 70.22,24.65
  Top 0.305: J2.2 57.53,19.15 58.55,18.13 v59.89,18.13
  Top 0.406: C97.2 64.35,27.92 63.96,27.53 v63.96,27.4 v63.97,27.4 64.35,27.02 C101.2 | C95.2 65.05,31.89 65.05,31.29 v64.97,31.21 64.36,31.21 C92.2 | C56.2 64.67,19.91 v64.44,19.68
  Top 0.508: J2.3 60.48,18.72 v59.89,18.13 | C125.1 64.44,17.92 | 64.44,17.92 64.47,17.92 64.47,17.59 64.56,17.49 C57.2 | 64.44,17.92 v64.44,19.68 | C78.2 59.89,26.64 v59.77,26.51 | C102.2 66.5,22.33 v66.75,22.08 v66.75,22.07 67.51,22.07 v67.64,21.94 68.91,21.94 v69.04,21.81 | C126.1 62.81,22.76 v62.81,20.42 | C60.2 v53.54,19.58 | D16.1 57.23,24.66 v55.78,24.66 | C120.1 57.89,16.97 58.2,16.66 v59.89,16.66 | C54.2 v50.61,31.96 v50.61,29.42 C53.2
  Bottom 0.305: 62.05,21.43 IC7.16 | IC7.13 63.07,21.43
  Bottom 0.406: v59.77,26.51 59.65,26.51 59.27,26.89 IC6.16 IC6.15 60.02,27.53 IC6.14 IC6.13 60.77,26.77 60.83,26.71 v60.83,26.51 | R75.1 52.91,28.84 v52.91,29.43 52.91,30.08 R80.1 | v58.75,31.72 58.75,31.85 59.5,32.6 C86.2 C87.2 | v62.81,20.42 63.07,20.67 63.07,21.43 IC7.14 62.56,21.43 IC7.15 62.05,21.43 v62.05,20.42 | C90.2 C89.2 | C134.2 v50.61,29.42 | C135.2 v50.61,31.96
  Bottom 0.508: C74.2 C73.2 R63.2 70.31,20.8 69.29,21.81 v69.04,21.81 | v63.96,27.4 64.08,27.28 C90.2 | C91.2 70.82,29.68 v70.82,27.4 70.82,26.55 C128.1 | 68.78,21.81 C103.2 | R108.1 74.12,30.7 v72.97,29.56 | C70.2 C69.2 59.25,17.49 v59.89,18.13 59.89,17.76 C72.2 60.28,17.05 v59.89,16.66 59.89,16.13 C71.2 | IC5.3 54.78,14.54 v55.4,14.75 | C65.2 R57.2 v48.59,13.69 | R59.2 64.92,20.16 v64.44,19.68 | C61.2 C62.2 v53.54,19.58 | R87.1 56.36,25.24 v55.78,24.66 55.78,24.82 C84.2
  Bottom 0.61: IC7.EXP 62.56,21.43 | 60.02,27.53 IC6.EXP | 68.78,21.81 67.77,21.81 v67.64,21.94 | C52.1 v53.54,19.58 | C117.1 70.04,17.48 v70.18,17.62
  other vias: 72.97,27.4 75.01,27.4 72.97,25.24
  pour Route2 (isolate 0.127, rank 2): 48.97,33.34 48.97,28.16 49.35,27.66 49.9,27.64 51.04,29.29 52.19,29.29 52.78,26.64 54.05,24.23 54.05,21.05 53.54,20.67 52.15,20.16 51.68,19.77 51.64,18.39 49.1,17.37 43.26,16.61 42.24,15.72 43,13.94 44.27,13.31 47.45,12.92 56.72,14.32 59.59,15.06 70.83,15.09 70.82,19.7 69.04,22.5 69.04,23.97 76.4,23.97 76.4,30.83 70.22,30.83 70.22,32.98 64.63,32.98 59.95,32.23 59.28,32.1 52.95,32.09 50.92,33.36 49.01,33.36
  cutout Route2: 66.34,17.24 67.01,17.37 67.01,19.27 65.35,19.27 64.97,18.51 64.97,17.88
  cutout Route2: 61.42,23.21 60.4,23.21 60.07,23.54 59.31,23.54 59.13,23.72 58.62,23.72 58.62,21.94 59.13,21.94 59.31,22.12 60.07,22.12 60.4,22.45 61.42,22.45
  cutout Route2: 58.88,29.31 58.17,29.31 57.58,29.89 57,29.89 56.57,30.32 56.13,30.32 56.13,28.55 57,28.55 57.09,28.45 57.83,28.45 57.9,28.53 58.88,28.55
  pour Bottom (isolate 0.127): 76.4,24 68.91,24 68.91,21.31 66.5,21.31 65.99,21.81 65.99,22.7 66.62,23.34 66.62,29.69 65.86,30.45 65.1,30.45 64.72,30.83 64.72,32.61 65.1,32.99 70.23,32.99 70.23,30.83 76.4,30.83
  cutout Route2: 48.72,15.34 49.35,14.96 49.99,14.96 51.89,14.7 51.89,14.32 50.88,14.32 49.35,14.45 47.32,14.32 47.07,15.46 47.07,16.1 47.58,16.1 48.08,15.34
AMP1_INM
  Bottom 0.254: IC5.4 C63.1 R52.2 R57.1 R53.1
AMP2_INM
  Bottom 0.254: IC2.4 65.93,18.19 C68.1 | R56.1 66.06,18.19 IC2.4 | IC2.4 65.48,18.22 R59.1
AMP_VCM1  (via drill 0.4)
  Top 0.203: v62.31,30.96 62.31,31.06 62.34,31.09 63.24,31.09 | IC10.2 67.82,30.65 67.22,31.25 65.99,31.25 65.17,30.43 63.62,30.43 63.24,30.81 63.24,31.09 | C92.1 63.24,31.09
  Bottom 0.254: IC6.9 61.55,29.68 62.06,30.18 62.06,30.71 v62.31,30.96
AMP_VCM2  (via drill 0.35)
  Top 0.203: IC10.15 67.82,24.15 67.01,23.34 65.9,23.34 C102.1 65.51,23.33 v64.48,24.36
  Bottom 0.254: IC7.9 63.96,23.84 v64.48,24.36
ANODE
  Top 0.254: D15.3 R51.2 45.29,15.08
  Top 0.406: ANODE.P$1 45.29,15.08
  Bottom 0.254: R53.2 46.3,15.08 C65.1
  Bottom 0.406: R53.2 ANODE.P$1
ANODE_AMP_OUTN  (via drill 0.35)
  Top 0.203: IC10.5 67.92,29.15 67.35,29.73 66.78,29.73 C82.1 66.51,29.57 66.24,29.31 v65.99,29.31
  Bottom 0.203: v65.99,29.31 65.99,25.84 R79.2
ANODE_AMP_OUTP  (via drill 0.35)
  Top 0.203: v65.48,29.94 65.61,29.94 66.11,30.44 66.5,30.44 C82.2 66.75,30.44 66.75,30.41 67.3,30.41 68.06,29.65 IC10.4
  Bottom 0.203: v65.48,29.94 65.36,29.82 R85.2
ANODE_PREAMP_OUT  (via drill 0.35)
  Top 0.254: v55.83,20.67 R76.1
  Bottom 0.254: 56.03,20.24 56.03,18.61 56.77,18.06 | IC2.3 62.66,18.19 61.13,18.83 58.94,18.83 58.62,18.82 56.77,18.06 | 56.77,18.06 56.77,16.93 55.75,16.43 IC5.1 53.08,17.1 52.57,17.1 51.83,17.79 51.3,17.79 50.41,17.1 C63.2 R52.1 | v55.83,20.67 56.08,20.43 56.22,20.43
  Bottom 0.305: 56.03,20.24 56.22,20.43 R77.1
BIAS_FILT
  Top 0.203: R51.1 47.49,16.97 48.12,16.97 49.77,17.61 52.27,18.51 53.16,18.51 C60.1
  Top 0.254: R49.2 C60.1
BOOT0  (via drill 0.35)
  Top 0.203: IC8.44 103.7,23.73 103.96,23.47 v104.09,23.47
  Route15 0.203: v104.09,23.47 106.76,26.13 107.39,26.13 108.59,27.33 108.59,30.5 v108.46,30.63
  Bottom 0.203: v108.46,30.63 108.51,30.58 R65.1 109.05,30.96 109.92,31.83 R64.2
BOOT_CONTROL  (via drill 0.35)
  Top 0.203: 109.49,15.59 J4.2
  Top 0.406: v110.44,16.48 109.49,15.59
  Bottom 0.203: v110.44,16.48 110.73,18.62 110.73,30.05 110.21,30.58 R65.2
CH1COAX
  Top 0.254: C137.1 58.11,22.07 59,21.17 J2.1
CH1COAX_DC
  Top 0.254: R76.2 56.59,22.57 56.98,22.96 C137.2
CH2COAX
  Top 0.305: C136.2 53.32,28.65 53.92,29.25 J3.1
CH2COAX_DC
  Top 0.305: R58.1 54.43,27.87 C136.1 54.41,28.07 R60.1
CLK20M_N  (via drill 0.35)
  Top 0.254: IC8.5 107,27.03 v107.27,26.77
  Route15 0.254: v94.87,21.43 95.49,22.06 98.04,22.06 98.3,22.31 100.83,22.31 102.24,23.72 102.95,23.72 106,26.77 v107.27,26.77
  Bottom 0.254: J1.3 93.22,20.72 93.78,21.28 94.72,21.28 v94.87,21.43
CLK20M_P  (via drill 0.35, 0.5)
  Top 0.254: IC9.18 89.8,28.42 90.32,27.91 v92.35,27.91
  Route15 0.254: v92.35,27.91 92.35,26.77 91.77,26.19 91.77,23.91 92.51,23.17 92.51,21.26 91.85,20.6 v91.85,17.17
  Bottom 0.406: J1.2 91.9,15.7 91.9,17.12 v91.85,17.17
CW_1_KB
  Top 0.305: D12.3 C15.2 C16.1
CW_2_1
  Top 0.305: C14.2 12.94,10.62 D11.3 13.96,9.23 C15.1
CW_3_2
  Top 0.305: C13.2 7.48,17.99 7.74,16.46 D10.3 8.5,13.8 C14.1
CW_4_3
  Top 0.305: C12.2 7.36,24.34 D9.3 7.48,22.94 7.36,22.18 C13.1
CW_5_4
  Top 0.305: C11.2 8.12,32.47 D8.3 C12.1
CW_6_5
  Top 0.305: C10.2 15.99,39.83 14.72,38.82 D7.3 C11.1
CW_7_6
  Top 0.305: C9.2 D6.3 22.09,43.9 20.95,43.26 C10.1
CW_8_7
  Top 0.305: C9.1 30.72,45.29 D5.3 33.26,44.41 35.68,42.5 C8.2
CW_9_8
  Top 0.305: D4.3 38.22,35.52 36.31,37.04 C7.2 C8.1
CW_10_9
  Top 0.305: D3.3 37.58,29.55 C6.2 36.57,33.99 C7.1
CW_A_10
  Top 0.305: D2.3 35.68,29.29 C5.2
  Top 0.406: C6.1 C5.2
CW_KA_K
  Top 0.305: C17.2 D14.3
CW_KB_KA
  Top 0.305: C16.2 D13.3 C17.1
DISCRIM_IN+
  Bottom 0.203: IC3.2 74.66,18.95 73.44,17.73 71.36,17.73 70.56,18.54 67.98,18.54 | IC2.1 63.74,15.63 66.41,15.63 66.88,15.97 67.39,16.48 67.59,17.05 R56.2 67.63,17.78 67.98,18.13 67.98,18.54 | 67.98,18.54 C68.2
DISCRIM_IN-
  Bottom 0.203: C73.1 C74.1 75.18,19.66 IC3.3 | C73.1 R63.1 | R62.1 71.75,18.7 71.75,19.5 C73.1
  Bottom 0.254: R63.1 70.24,19.73 69.1,19.73 R61.1
DISCRIM_LEVEL  (via drill 0.35)
  Top 0.203: IC8.14 105.2,32.23 105.32,32.36 v105.36,32.36 | v73.61,19.02 74.62,20.03 92.66,20.03 94.59,21.97 95.12,21.97 96.06,22.91 v96.06,22.93
  Route15 0.152: v96.06,22.93 96.55,22.45 97.72,22.45 98.22,22.96 98.43,22.96 99.03,23.55 99.03,24.11 97.78,25.36 97.78,25.74 98.14,26.19 99.72,26.64 102.06,26.64 105.36,29.94 v105.36,32.36
  Bottom 0.203: v73.61,19.02 73.55,19.02 73.12,18.58 R62.2
DRV_FILT
  Top 0.254: L2.2 28.69,18.46 C18.1 27.73,18.59 C4.2
DRV_L1INP
  Top 0.254: C4.1 26.1,19.98 R3.2
  Top 0.406: R3.2 24.5,21.67 24.04,23.15 L3.2
DRV_L1OUT
  Top 0.406: L3.1 20.52,24.15 21.4,26.46 L4.1
DRV_L2INP
  Top 0.406: L4.2 22.25,28.4 22.74,28.66 C19.1
  Top 0.508: C19.1 25.15,29.43 25.99,29 L5.2
DRV_L2OUT
  Top 0.406: L6.2 31.11,33.74 L5.1
DRV_OUT
  Top 0.406: C20.1 33.52,29.16 C5.1 L6.1
DRV_SQUARE
  Top 0.254: IC1.4 32.52,19.91 31.07,18.97 L2.1
DY1
  Top 0.508: R26.2 DY1.P$1
  Bottom 0.508: C46.1 DY1.P$1 C45.2
  pour Route15 (no thermals): 21.71,9.61 21.68,11.11 21.07,11.77 18.66,13.42 18.02,13.42 17.26,12.78 17.03,12.4 17.29,10.62 18.53,9.35 21.58,9.35
DY1A  (via drill 0.35)
  Top 0.305: D11.1 16.88,9.23 18.28,8.34 R26.1 | R26.1 D12.2 | R26.1 v20.06,7.7
  Bottom 0.305: R12.2 18.53,8.21 C30.2 v20.06,7.7 R13.1 C31.1
  pour Route15: 22.09,8.72 21.71,8.97 18.66,8.84 17.26,9.35 16.88,10.11 16.75,11.51 16.5,11.89 15.99,11.77 15.41,11.18 15.38,10.04 15.74,9.48 17.9,8.46 18.56,7.7 18.56,6.05 18.79,4.78 19.17,4.02 20.31,3.13 21.33,3.26 21.55,3.89 21.55,4.98 21.33,5.62 21.33,7.07 21.83,7.57 22.09,7.96
DY2
  Top 0.508: R25.2 DY2.P$1
  Bottom 0.508: C45.1 DY2.P$1 C44.2
  pour Route15 (no thermals): 12.87,16.85 12.94,16.34 13.88,14.81 14.59,14.18 16.25,13.16 16.6,13.29 17.39,14.18 17.36,14.81 15.99,16.59 14.85,17.3 13.2,17.3
DY2A  (via drill 0.35)
  Top 0.305: D11.2 v14.21,13.04 | D10.1 v11.93,15.07 R25.1
  Route15 0.305: v11.93,15.07 12.31,13.29 v14.21,13.04
  Bottom 0.305: v14.21,13.04 R12.1 14.59,8.21 C30.1 | v11.93,15.07 R11.2 C29.2
  pour Route15: 17.39,7.83 17.74,7.45 17.74,6.3 17.52,5.8 16.88,5.54 7.1,12.53 6.85,13.29 7.1,14.31 7.61,14.79 9.26,14.79 9.64,15.19 10.02,15.45 12.18,15.45 12.82,13.67 14.85,13.29 15.36,12.88 15.23,12.5 14.49,11.82 14.52,9.56 15.36,8.72
DY3
  Top 0.508: R24.2 DY3.P$1
  Bottom 0.508: C43.2 DY3.P$1 C44.1
  pour Route15 (no thermals): 13.07,18.19 14.34,18.19 14.82,18.75 14.82,19.39 13.96,22.69 13.07,23.17 12.05,23.17 11.67,22.81 11.67,20.02
DY3A  (via drill 0.35)
  Top 0.305: D9.1 v10.4,18.12 | R24.1 v10.4,18.12 | D10.2 v10.4,18.12
  Bottom 0.305: R10.2 C28.2 v10.4,18.12 R11.1 C29.1
  pour Route15: 10.58,23.25 9.77,23.25 9.39,22.94 9.26,22.69 9.26,22.18 9.67,21.42 9.67,17.86 8.63,16.85 7.86,16.85 7.23,16.72 6.87,16.31 6.95,15.8 7.41,15.58 8.68,15.58 9.06,15.8 9.39,16.34 11.24,16.52 11.67,16.97 11.67,17.48 11.04,18.5 11.06,22.92
DY4
  Top 0.508: R23.2 DY4.P$1
  Bottom 0.508: C42.2 DY4.P$1 C43.1
  pour Route15 (no thermals): 11.67,24.47 11.93,23.98 13.32,23.98 13.83,24.21 14.59,25.74 14.98,27.39 14.85,28.28 14.47,28.5 13.32,28.5 12.82,28.28 11.55,26.88
DY4A  (via drill 0.35)
  Top 0.305: R23.1 v10.15,26.12 D9.2 | v10.91,28.91 D8.1
  Route15 0.305: v10.91,28.91 v10.15,26.12
  Bottom 0.305: C28.1 R10.1 8.37,25.23 v10.15,26.12 | R9.2 C27.2 v10.91,28.91
  pour Route15: 9.52,24.14 10.4,24.21 10.79,24.72 10.63,27.13 12.08,29.32 12.05,29.93 11.67,30.38 10.73,30.41 10.4,30.18 8.91,30.26 8.45,30.89 6.97,31.7 6.47,31.63 6.09,30.74 5.83,28.66 5.83,18.24 6.59,17.48 7.99,17.61 8.63,18.12 8.83,18.62 8.83,20.78 8.37,21.8 8.37,22.81 8.63,23.45
DY5
  Top 0.508: R22.2 DY5.P$1
  Bottom 0.508: C42.1 DY5.P$1 C41.2
  pour Route15 (no thermals): 17.11,32.92 17.26,32.21 15.99,30.31 14.59,29.32 13.32,29.32 12.94,29.67 12.82,30.69 12.94,31.58 15.48,33.86 16.17,33.81
DY5A  (via drill 0.35)
  Top 0.305: R22.1 v12.69,32.59 | D8.2 v12.69,32.59 | D7.1 v12.69,32.59
  Bottom 0.305: R9.1 C27.1 v12.69,32.59 R8.2 C26.2
  pour Route15: 17.54,39.3 18.66,40.34 19.8,40.59 20.03,40.9 20.01,41.31 19.17,42.12 18.41,42.25 17.26,41.86 7.1,34.75 6.97,33.48 7.48,32.72 9.52,31.22 11.78,31.22 14.47,33.99 14.59,34.5 13.71,35.39 13.71,36.02 14.72,37.8
DY6
  Top 0.508: R21.2 19.42,37.29 DY6.P$1
  Bottom 0.508: C41.1 DY6.P$1 C40.2
  pour Route15 (no thermals): 16.88,35.13 20.06,38.31 20.44,38.31 21.2,37.42 21.2,37.04 19.67,36.15 19.42,35.64 19.04,33.99 18.28,33.36 17.72,33.51 16.83,34.4
DY6A  (via drill 0.35)
  Top 0.305: D6.1 v22.34,41.1 | R21.1 v16.63,37.42 D7.2
  Route15 0.305: v16.63,37.42 20.44,39.83 21.33,40.72 v22.34,41.1
  Bottom 0.305: R7.2 C25.2 v22.34,41.1 | C26.1 17.52,38.18 v16.63,37.42 R8.1
  pour Route15: 15.74,37.29 14.85,36.28 14.85,35.9 15.48,35.26 15.86,35.26 16.88,36.15 17.26,37.29 18.28,37.93 19.04,38.05 19.93,38.82 20.06,39.33 21.28,40.47 23.23,40.98 23.56,41.36 23.59,42.8 24.4,43.54 24.63,44.02 24.63,45.29 24.4,45.78 23.48,46.18 19.8,43.64 19.55,43.01 19.8,42.63 21.07,41.48 20.97,40.59 20.06,39.71 19.17,39.71 18.15,38.82
DY7
  Bottom 0.508: R48.2 28.06,39.83 DY7.P$1
DY7A  (via drill 0.35)
  Top 0.305: D5.1 v29.71,42.88 v26.28,42.63 | v26.28,42.63 D6.2 | R20.1 v26.28,42.63
  Bottom 0.305: C24.2 v29.71,42.88 R6.2 | C25.1 v26.28,42.63 R7.1
  pour Route15: 24.4,42.3 24.4,41.36 24.63,40.98 26.91,40.98 28.82,42.12 29.96,41.99 30.47,41.86 31.05,41.86 31.05,43.21 30.83,43.47 30.34,43.52 29.78,44.2 29.73,45.93 29.23,46.44 25.9,46.44 25.52,45.93 25.52,43.39 24.63,42.75
  pour Route2: 29.45,42.88 30.47,41.23 30.47,39.71 30.85,39.45 31.61,39.45 31.87,39.71 31.87,41.23 29.84,43.13
DY7B  (via drill 0.35)
  Top 0.305: v24.37,40.09 R20.2
  Bottom 0.254: R48.1 28.69,41.86 29.58,41.86 30.72,41.23
  Bottom 0.305: C40.1 v24.37,40.09 R48.1 | 30.72,41.23 C39.2
  pour Route15 (no thermals): 21.45,39.58 20.95,39.07 20.95,38.94 21.83,38.05 22.09,38.05 25.26,39.07 28.06,39.2 28.31,39.71 27.93,40.47 24.37,40.47
DY8
  Top 0.508: R47.2 DY8.P$1
  Bottom 0.508: DY8.P$1 C55.1
  pour Route15 (no thermals): 46.98,31.7 46.98,30.56 46.73,30.31 45.2,30.31 43.55,31.45 43.8,32.34 45.71,31.83 46.85,31.83
DY8_AMP_IN  (via drill 0.4)
  Top 0.305: v53.29,27.05 53.29,26.41 53.84,25.86 54.41,25.86 R58.2 55.8,25.89 55.85,25.84
  Top 0.406: 55.85,25.84 D16.3
  Bottom 0.254: C135.1 52.06,31.32 C134.1 52.19,30.56 52.19,29.29 52.34,28.1 R75.2 v53.29,27.05 R68.1
  Bottom 0.305: C55.2 49.71,31.19 C134.1
DY8A  (via drill 0.35)
  Top 0.305: D5.2 v33.64,42.25 | D4.1 v42.92,36.15
  Route15 0.508: v33.64,42.25 37.58,40.72 39.23,39.45 v42.92,36.15
  Bottom 0.305: v33.64,42.25 C24.1 R6.1 | R19.1 v42.92,36.15 R5.2 C23.2
  pour Route15: 34.03,40.21 37.2,40.21 38.98,38.94 39.23,38.18 39.74,37.55 39.97,37.04 42.15,35.39 43.42,35.39 43.42,36.15 38.09,40.72 36.31,43.01 32.38,46.18 31.49,46.31 30.93,45.93 30.9,44.53 31.08,44.2 31.94,43.72 31.94,42.2 32.22,41.86 34.03,41.61
  pour Route2: 33.52,42.63 32.63,41.1 32.63,39.83 33.01,39.45 33.64,39.45 34.03,39.83 34.03,41.48 34.15,42.25 33.77,42.63
DY8B  (via drill 0.35)
  Top 0.305: R41.1 v44.95,35.77
  Bottom 0.203: 38.98,40.34 37.58,40.98 34.79,41.74 33.9,41.23
  Bottom 0.254: 38.98,40.34 42.03,37.93 44.31,36.4 44.4,36.28 R19.2
  Bottom 0.305: R19.2 v44.95,35.77 C49.1 | C39.1 33.9,41.23
  pour Route15: 44.95,36.15 46.34,35.52 46.73,34.88 46.73,33.99 45.33,33.99 44.57,35.77
DY8C  (via drill 0.35)
  Top 0.305: R47.1 R41.2 v45.46,32.98 C54.1
  pour Route2: 45.08,33.1 46.34,33.74 46.73,33.74 47.11,33.36 47.11,32.34 46.85,32.09 46.09,32.09 45.08,32.85
DY9
  Top 0.508: R46.2 DY9.P$1
  pour Route2 (no thermals): 47.19,29.18 47.19,26.01 46.56,25.24 45.67,25.5 44.65,28.93 46.18,29.56 46.94,29.56
DY9_AMP_OUTN  (via drill 0.35)
  Top 0.203: IC10.12 67.92,25.65 67.22,24.95 66.78,24.95 C77.1 66.09,25.11 65.48,25.71 64,25.71 63.2,26.51 63.2,28.16 64.08,29.05 v64.34,29.05
  Bottom 0.254: v64.34,29.05 64.08,28.8 R70.2
DY9_AMP_OUTP  (via drill 0.35)
  Top 0.203: IC10.13 68.06,25.15 67.17,24.27 66.78,24.27 C77.2 66.4,24.11 65.23,25.28 63.79,25.28 62.81,26.26 62.81,28.29 v64.34,29.82
  Bottom 0.254: v64.34,29.82 64.08,30.07 R74.2
DY9A  (via drill 0.35)
  Top 0.305: v42.41,26.12 41.52,26.12 D3.1 | D4.2 v37.71,38.05
  Bottom 0.305: R18.1 v42.41,26.12 C22.2 41.39,30.05 R4.2 R5.1 C23.1 v37.71,38.05
  pour Route15: 42.92,28.73 40.76,31.83 40.63,34.63 39.74,35.52 39.66,35.85 39.16,36.91 38.73,37.42 38.47,38.18 37.58,38.94 36.57,39.33 36.19,39.45 34.53,39.45 33.9,38.69 33.52,36.78 33.77,35.9 34.41,35.01 35.3,34.5 36.19,34.24 38.34,34.63 39.36,33.48 39.49,31.58 41.85,28.38 41.85,26.93 42.38,25.02 42.79,24.72 43.17,24.85 43.04,28.15
DY9B  (via drill 0.35)
  Top 0.305: v44.4,24.99 R40.1
  Bottom 0.305: R18.2 v44.4,24.99 C38.2
  pour Route15 (no thermals): 43.56,25.55 44.35,25.96 45.7,24.33 44.82,23.48 44.31,23.7 43.59,24.81
DY9C
  Top 0.305: C53.1 R46.1 43.77,28.55 R40.2
DY10
  Bottom 0.305: R45.2 DY10.P$1
  pour Route15 (no thermals): 47.58,19.78 48.97,20.16 49.48,20.16 49.73,19.78 49.72,18.65 49.47,18.34 49.11,18.17 47.01,18.12 46.17,18.27 45.25,20.25 45.29,20.93 46.05,21.31
DY10A  (via drill 0.35)
  Top 0.305: D2.1 v41.9,21.8 44.65,22.32 46.09,23.58 46.73,23.83 D1.A v48.84,25.12 | v39.49,29.04 D3.2
  Route15 0.508: v39.49,29.04 41.01,25.36 v41.9,21.8
  Bottom 0.305: C21.2 v41.9,21.8 41.98,21.77 R17.1 | C22.1 v39.49,29.04 R4.1 | R32.2 v48.84,25.12
  pour Route15: 36.46,31.91 37.33,26.75 37.73,26.19 40.63,25.36 40.88,23.7 40.07,21.9 40.05,20.83 40.25,20.5 41.04,20.38 42.36,21.24 42.34,22.42 41.52,24.47 41.01,26.62 41.01,28.02 39.99,29.29 37.84,31.83 37.58,33.23 37.2,33.48 36.69,33.48 36.44,33.23 36.44,32.85
  pour Route2 (no thermals): 49.1,25.37 48.59,25.37 47.7,24.1 47.96,22.32 48.97,22.32 49.23,22.83 49.23,24.23
DY10B  (via drill 0.35)
  Route15 0.305: v46.85,22.18 45.71,22.31 v43.98,20.82
  Bottom 0.305: R39.1 C37.2 v43.98,20.82 R17.2 | C38.1 v46.85,22.18 R38.2
  pour Route15 (no thermals): 42.28,20.02 42.28,19.39 42.53,19.13 43.8,19 44.95,18.24 45.58,18.24 45.58,18.5 44.57,20.02 44.57,21.29 43.8,21.29
  pour Route15: 46.85,22.43 48,22.18 49.01,22.18 49.01,21.16 48.76,20.78 48.25,20.78 46.47,22.05
DY10B_MON_A
  Bottom 0.305: R38.1 R37.2
DY10B_MON_B  (via drill 0.35)
  Top 0.203: v56.59,18.89 56.13,18.89 54.99,19.91 v54.48,20.8 | v88.44,21.1 89,21.66 91.03,21.66 91.31,21.94 93.4,21.94 94.39,22.93 94.64,22.93 v94.77,23.06
  Route15 0.203: v56.59,18.89 57.1,19.4 63.2,19.4 64.34,20.54 69.93,20.54 70.31,20.93 88.27,20.93 v88.44,21.1
  Bottom 0.203: v94.77,23.06 95.4,23.7 96.06,23.7 96.67,24.3 100.24,24.3 100.54,24.61 C51.1 101.05,25.75 R36.2
  Bottom 0.254: R37.1 v54.48,20.8
DY10C
  Bottom 0.305: C52.2 R45.1 46.81,18.51 R39.2
FPGA_C_!CS  (via drill 0.35)
  Top 0.152: IC9.16 89.66,27.42 90.19,26.89 93.24,26.89 97.01,30.66 v98.38,30.66 98.5,30.53 IC8.25
  Bottom 0.203: v98.38,30.66 98.32,30.66 R95.1
FPGA_CRESET_B  (via drill 0.35)
  Top 0.203: IC9.8 85.86,24.04 86.31,23.59 89.36,23.59 90.5,24.74 92.81,24.74 v93.14,25.07 | v101.8,32.1 101.7,31.99 IC8.21
  Bottom 0.152: v101.8,32.1 101.55,31.85 101.04,31.85 97.36,28.16 95.71,28.16 93.14,25.6 v93.14,25.07
FPGA_DRDY
  Top 0.152: IC9.13 89.13,25.92 89.3,25.75 93.7,25.75 96.5,28.55 99.5,28.55 IC8.29
FPGA_RESTART  (via drill 0.35)
  Top 0.203: IC9.12 87.86,25.09 87.99,24.97 89.11,24.97 89.41,25.27 v92.46,25.27 | v101.09,32.36 101.2,32.25 IC8.22
  Bottom 0.152: v101.09,32.36 101.09,32.33 97.28,28.52 95.43,28.52 92.46,25.55 v92.46,25.27
GND  (via drill 0.35, 0.5)
  Top 0.254: IC10.41 78.05,27.66 78.06,27.65 | IC8.49 105.2,25.53 IC8.47 105.2,23.68 105.21,23.7 | IC8.49 103.7,28.53 IC8.8 106.39,28.55 v107.9,28.55 | IC8.49 100.7,25.53 IC8.35 98.59,25.53 v98.5,25.62 | 105.21,23.21 v104.83,22.83 | IC8.49 102.86,27.78 100.7,29.95 IC8.23 100.7,31.94 100.38,32.25 100.38,32.83 100,33.21 C99.2
  Top 0.305: 78.06,27.65 78.38,27.65 | IC11.2 v104.98,20.93 | v95.38,17.9 IC13.2 | C123.2 92.84,17.28 v92.84,17.39 | R104.1 97.02,34.05 C121.1
  Top 0.406: 105.21,23.7 105.21,23.21 | C99.2 99.64,33.23 | v39.49,24.09 D2.2 | v34.28,22.18 34.28,24.97 C20.2 | v83.31,17.47 83.45,17.61 IC4.3 85.21,17.58 86.06,16.73 v86.31,16.73 | C131.1 104.72,33.87 v104.73,33.88 | J4.1 108.64,13.03 v108.66,13.05 | IC1.2 v36.82,19.26 | C18.2 28.85,17.39 C2.1 | R3.1 24.82,19.8 v25.31,19.56 | R2.1 51.64,27.61 v51.51,28.67 | C118.2 105.06,15.73 v105.06,14.91
  Top 0.508: 78.38,27.65 78.56,27.84 78.78,27.83 C105.2 79.42,27.82 79.88,28.29 v79.88,28.34 | v79.86,29.2 79.88,29.18 | v98.5,25.62 98.38,25.62 98.13,25.87 C88.2 | C85.2 105.44,23.01 105.06,23.01 104.93,22.88 104.83,22.88 v104.83,22.83 | 99.64,33.23 v99.64,33.88 99.48,34.05 C121.1 | C133.2 93.7,12.6 v93.6,12.7 | C124.2 98.09,13.85 v98.05,13.81 v98.04,13.81 C122.2 | v104.39,13.74 103.84,13.19 C127.2 | C109.2 91.29,32.25 v90.8,32.74 | C113.2 v109.04,17.88 | C93.2 109.01,29.15 108.41,28.55 v107.9,28.55 108.28,28.55 108.86,27.97 C94.2 | C19.2 24.88,27.13 v25.19,26.8 | J3.3 52.45,30.82 51.51,28.74 v51.51,28.67 | R60.2 55.45,29.13 55.45,31.77 | v101.88,20.82 101.81,20.76 C112.2
  Top 0.61: v55.45,33.24 55.45,31.77 J3.2 | C115.2 97.32,19.75 97.97,20.4 C114.2 99.26,20.4 | v34.84,17.41 v33.95,17.41 33.09,16.98 C1.1 C2.1 | J3.3 52.45,33.17 v52.53,33.24 | C64.1 86.54,16.5 v86.31,16.73 | C116.2 99.26,20.4 | 99.26,20.4 99.26,21.54 v99.21,21.59 | C58.2 72.88,15.88 v72.47,15.46 | v103.4,22.83 103.5,22.74 104.73,22.74 v104.83,22.83
  Top 0.762: 79.88,29.18 v79.88,28.34 79.88,28.39 v80.7,29.2 v79.86,29.2
  Route2 0.61: v71.2,33.75 70.56,33.8 65.48,33.8 61.2,33.02 59.27,32.72 v55.45,33.24 | v72.47,15.46 71.99,13.57 v70.05,12.8
  Route15 0.61: v98.05,13.81 97.27,14.58 95.52,14.58 95.11,14.18 91.16,14.17 90.88,14.45 v90.37,14.45
  Bottom 0.254: v102.95,29.18 98.86,29.18 97.11,27.43
  Bottom 0.305: C36.2 v51.51,28.67
  Bottom 0.406: IC12.2 95.84,30.68 | 95.84,30.68 95.84,30.45 C132.1 | 95.84,30.68 v95.89,30.63 96.45,30.07 R95.2 | v104.73,33.88 104.59,33.74 C34.2 102.49,33.74 R110.2 | C129.1 102.39,29.77 102.95,29.21 v102.95,29.18 | C21.1 v39.49,24.09